# Altium schematic sheet 学习型红外转发器-MCU.SchDoc: 学习型红外转发器-MCU
size A4; Organization: 智能实训室产品部; Address1: 广东省深圳市; Address2: 宝安区石岩凯普达工业园; DocumentNumber: 190405; Revision: V1.0; SheetNumber: 2; SheetTotal: 2; Date: 2019-04-09; ApprovedBy: 杨青; CheckedBy: 杨青; DrawnBy: 杨青; Engineer: 李剑平; ProjectName_GTA: 江工物联网; PCB Number: GS-X-GXM01
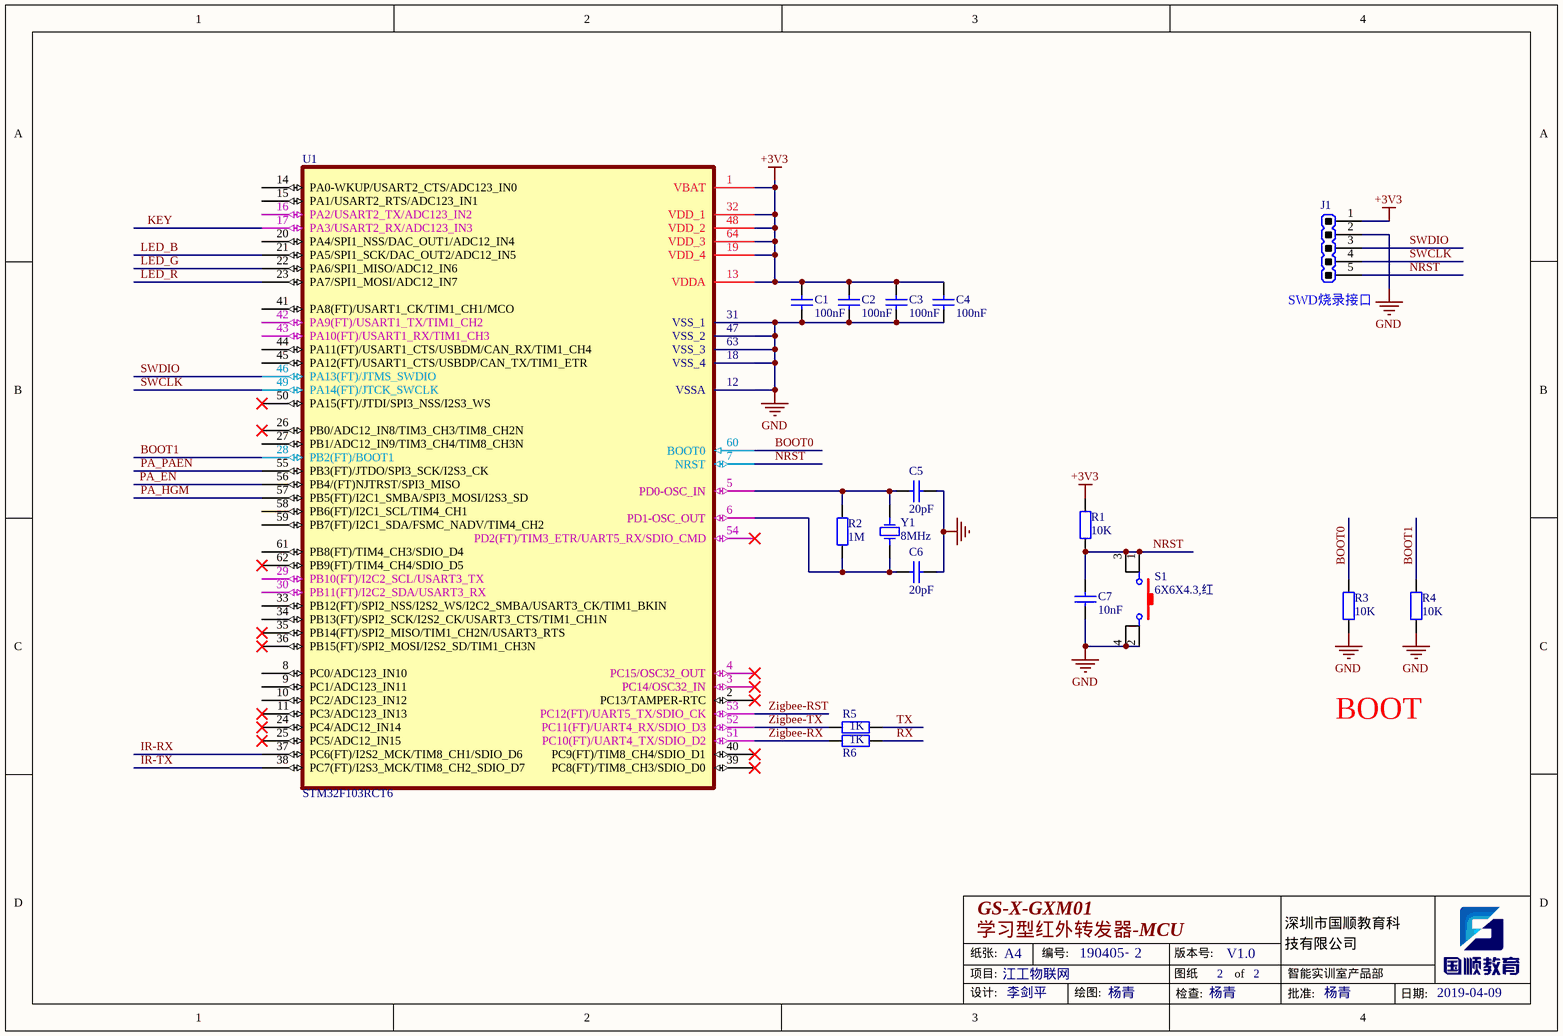
[diagram p0: 学习型红外转发器-MCU.SchDoc]

## Parts
C1  100nF  [C0603]
C2  100nF  [C0603]
C3  100nF  [C0603]
C4  100nF  [C0603]
C5  20pF  [C0603]
C6  20pF  [C0603]
C7  10nF  [C0603]
J1  HDRM-2.54/11-1*5P-AK  [HDRM-2.54-1*5P-AK]  (value not drawn)  (no BOM)
R1  10K  [R0603]
R2  1M  [R0603]
R3  10K  [R0603]
R4  10K  [R0603]
R5  1K  [R0603]
R6  1K  [R0603]
S1  6X6X4.3,红  [SW2-6.0X6.0X4.3-R-SMD]
U1  STM32F103RCT6  [LQFP64]
Y1  8MHz  [X_HC49-S]

## Nets
+3V3: C1.1 C2.2 C3.2 C4.2 J1.1 R1.1 U1.1(VBAT) U1.13(VDDA) U1.19(VDD_4) U1.32(VDD_1) U1.48(VDD_2) U1.64(VDD_3)
GND: C1.2 C2.1 C3.1 C4.1 C5.2 C6.2 C7.1 J1.2 R3.2 R4.2 S1.2 S1.4 U1.12(VSSA) U1.18(VSS_4) U1.31(VSS_1) U1.47(VSS_2) U1.63(VSS_3)
BOOT0: R3.1 U1.60(BOOT0)
BOOT1: R4.1 U1.28(PB2(FT)/BOOT1)
IR-RX: U1.37(PC6(FT)/I2S2_MCK/TIM8_CH1/SDIO_D6)
IR-TX: U1.38(PC7(FT)/I2S3_MCK/TIM8_CH2_SDIO_D7)
KEY: U1.17(PA3/USART2_RX/ADC123_IN3)
LED_B: U1.21(PA5/SPI1_SCK/DAC_OUT2/ADC12_IN5)
LED_G: U1.22(PA6/SPI1_MISO/ADC12_IN6)
LED_R: U1.23(PA7/SPI1_MOSI/ADC12_IN7)
NRST: C7.2 J1.5 R1.2 S1.1 S1.3 U1.7(NRST)
PA_EN: U1.56(PB4/(FT)NJTRST/SPI3_MISO)
PA_HGM: U1.57(PB5(FT)/I2C1_SMBA/SPI3_MOSI/I2S3_SD)
PA_PAEN: U1.55(PB3(FT)/JTDO/SPI3_SCK/I2S3_CK)
RX: R6.1
SWCLK: J1.4 U1.49(PA14(FT)/JTCK_SWCLK)
SWDIO: J1.3 U1.46(PA13(FT)/JTMS_SWDIO)
TX: R5.1
Zigbee-RST: U1.53(PC12(FT)/UART5_TX/SDIO_CK)
Zigbee-RX: R6.2 U1.51(PC10(FT)/UART4_TX/SDIO_D2)
Zigbee-TX: R5.2 U1.52(PC11(FT)/UART4_RX/SDIO_D3)
NetC5_1: C5.1 R2.2 U1.5(PD0-OSC_IN) Y1.2
NetC6_1: C6.1 R2.1 U1.6(PD1-OSC_OUT) Y1.1

Not connected (* = marked no-connect by the designer): U1 2(PC13/TAMPER-RTC)* 3(PC14/OSC32_IN)* 4(PC15/OSC32_OUT)* 8(PC0/ADC123_IN10) 9(PC1/ADC123_IN11) 10(PC2/ADC123_IN12) 11(PC3/ADC123_IN13)* 14(PA0-WKUP/USART2_CTS/ADC123_IN0) 15(PA1/USART2_RTS/ADC123_IN1) 16(PA2/USART2_TX/ADC123_IN2) 20(PA4/SPI1_NSS/DAC_OUT1/ADC12_IN4) 24(PC4/ADC12_IN14)* 25(PC5/ADC12_IN15)* 26(PB0/ADC12_IN8/TIM3_CH3/TIM8_CH2N)* 27(PB1/ADC12_IN9/TIM3_CH4/TIM8_CH3N) 29(PB10(FT)/I2C2_SCL/USART3_TX) 30(PB11(FT)/I2C2_SDA/USART3_RX) 33(PB12(FT)/SPI2_NSS/I2S2_WS/I2C2_SMBA/USART3_CK/TIM1_BKIN) 34(PB13(FT)/SPI2_SCK/I2S2_CK/USART3_CTS/TIM1_CH1N) 35(PB14(FT)/SPI2_MISO/TIM1_CH2N/USART3_RTS)* 36(PB15(FT)/SPI2_MOSI/I2S2_SD/TIM1_CH3N)* 39(PC8(FT)/TIM8_CH3/SDIO_D0)* 40(PC9(FT)/TIM8_CH4/SDIO_D1)* 41(PA8(FT)/USART1_CK/TIM1_CH1/MCO) 42(PA9(FT)/USART1_TX/TIM1_CH2) 43(PA10(FT)/USART1_RX/TIM1_CH3) 44(PA11(FT)/USART1_CTS/USBDM/CAN_RX/TIM1_CH4) 45(PA12(FT)/USART1_CTS/USBDP/CAN_TX/TIM1_ETR) 50(PA15(FT)/JTDI/SPI3_NSS/I2S3_WS)* 54(PD2(FT)/TIM3_ETR/UART5_RX/SDIO_CMD)* 58(PB6(FT)/I2C1_SCL/TIM4_CH1) 59(PB7(FT)/I2C1_SDA/FSMC_NADV/TIM4_CH2) 61(PB8(FT)/TIM4_CH3/SDIO_D4) 62(PB9(FT)/TIM4_CH4/SDIO_D5)*

## Notes on the sheet
- (near J1) SWD烧录接口
- BOOT
- 纸张:
- 项目:
- A4
- 编号:
- -
- 版本号:
- 图纸
- of
- 深圳市国顺教育科
- 技有限公司
- 设计:
- 绘图:
- 检查:
- 批准:
- 日期:

## Library data of the parts
C1-C4 = 100nF_50V_0603: Capacitor; 编码: 无; 规格/型号: 100nF,50V,0603; 物料名称: 贴片电容
C5 C6 = 20pF_50V_0603: Capacitor; 编码: 无; 规格/型号: 20pF,50V,0603; 物料名称: 贴片电容
C7 = 10nF_16V_0603: Capacitor; 编码: 无; 规格/型号: 10nF,16V,0603; 物料名称: 贴片电容
J1 = HDRM-2.54/11-1*5P-AK: 排针,直; 规格/型号: 排针,间距2.54,针长11mm,1*5P,180°直插; 物料名称: 排针
R1 R3 R4 = 10K_5%_0603: 10K,±5%,0603; 物料名称: 贴片电阻; 单价: 0.02; 规格/型号: 10K,±5%,0603
  R3 R4: 参数: ±5%
R2 = 1M_5%_0603: 1M,±5%,0603; 物料名称: 贴片电阻; 单价: 0.02; 规格/型号: 1M,±5%,0603; 参数: ±5%
R5 R6 = 1K_5%_0603: 1K,±5%,0603; 编码: 1010101190; 物料名称: 贴片电阻; 单价: 0.02; 规格/型号: 1K,±5%,0603; 参数: ±5%
S1 = SW-PB_6X6X4.3-4P-R-SMD: 6X6X4.3,红,贴片; 规格/型号: 轻触开关,6*6*4.3mm,4PIN,红色,贴片; 物料名称: 贴片轻触开关; 供应商: https://item.taobao.com/item.htm?id=40753584004&ali_refid=a3_430582_1006:1107660778:N:%E8%BD%BB%E8%A7%A6%E5%BC%80%E5%85%B3+4%E8%84%9A:8617e68bea4bb3f9b632d97741335970&ali_trackid=1_8617e68bea4bb3f9b632d97741335970&spm=a230r.1.14.1#detail
U1 = STM32F103RCT6-LQFP64_1: ARM Cortex-M3 32-bit MCU, 256 KB Flash, 48 KB Internal RAM, 51 I/Os, 64-pin LQFP, -40 to 85 degC, Tray; 物料名称: 贴片芯片; 编码: 1010501255; 规格/型号: STM32F103RCT6,LQFP64
Y1 = CRYSTAL_8M_HC49S: 8MHz,HC-49S; 编码: 1011201001; 规格/型号: 8MHz,HC-49S,插针式; 物料名称: 直插无源晶振